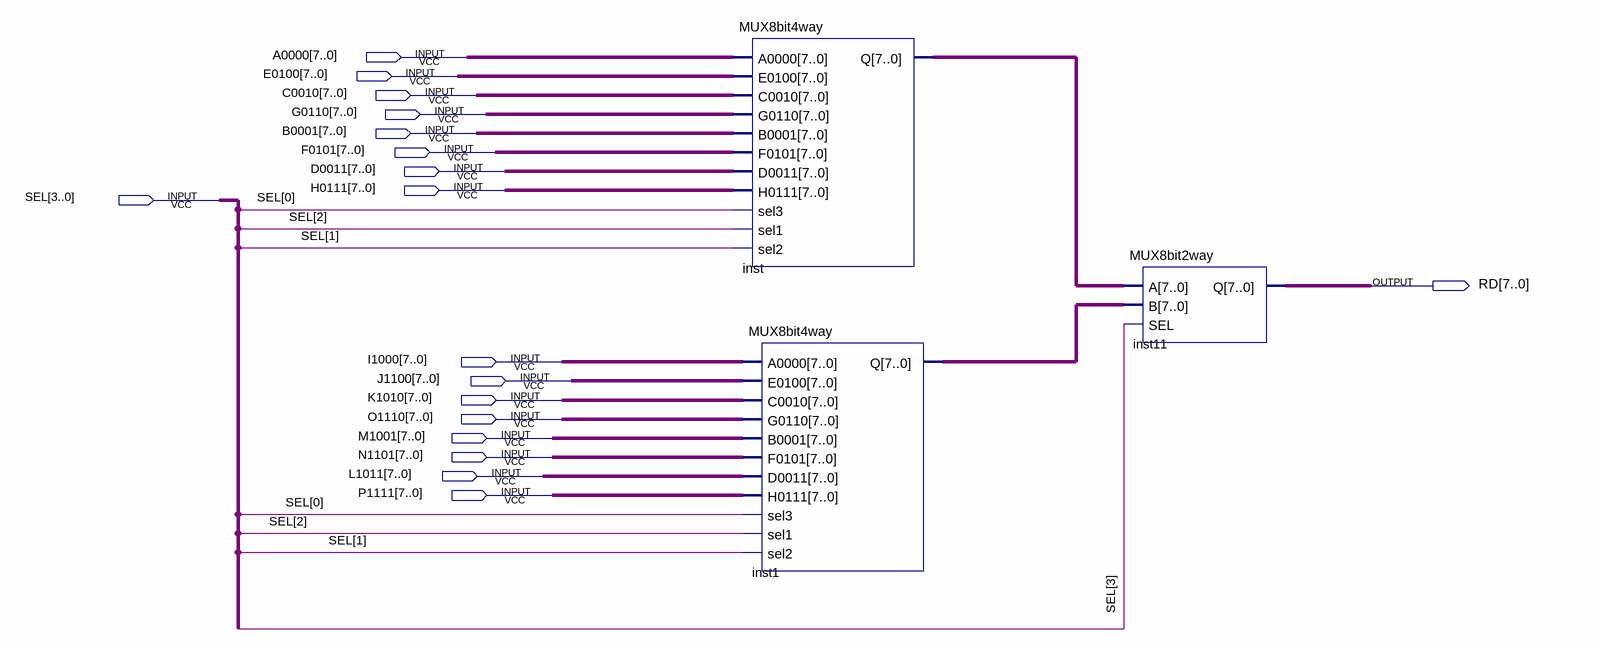
[diagram p0: schematic sheet]
// Quartus schematic MUX16.bdf as structural Verilog: 3 symbols, 18 pins
module MUX16 (
  input  [7:0] A0000,
  input  [7:0] E0100,
  input  [7:0] C0010,
  input  [7:0] G0110,
  input  [7:0] B0001,
  input  [7:0] F0101,
  input  [7:0] D0011,
  input  [7:0] H0111,
  input  [3:0] SEL,
  input  [7:0] I1000,
  input  [7:0] J1100,
  input  [7:0] K1010,
  input  [7:0] O1110,
  input  [7:0] M1001,
  input  [7:0] N1101,
  input  [7:0] L1011,
  input  [7:0] P1111,
  output [7:0] RD
);

  wire [7:0] inst1_q, inst_q;

  MUX8bit4way inst (
    .A0000(A0000), .E0100(E0100), .C0010(C0010), .G0110(G0110), .B0001(B0001), .F0101(F0101), .D0011(D0011),
    .H0111(H0111), .sel3(SEL[0]), .sel1(SEL[2]), .sel2(SEL[1]), .Q(inst_q));
  MUX8bit4way inst1 (
    .A0000(I1000), .E0100(J1100), .C0010(K1010), .G0110(O1110), .B0001(M1001), .F0101(N1101), .D0011(L1011),
    .H0111(P1111), .sel3(SEL[0]), .sel1(SEL[2]), .sel2(SEL[1]), .Q(inst1_q));
  MUX8bit2way inst11 (.A(inst_q), .B(inst1_q), .SEL(SEL[3]), .Q(RD));
endmodule
